# EAGLE design NewUD001 (EAGLE 6.1)
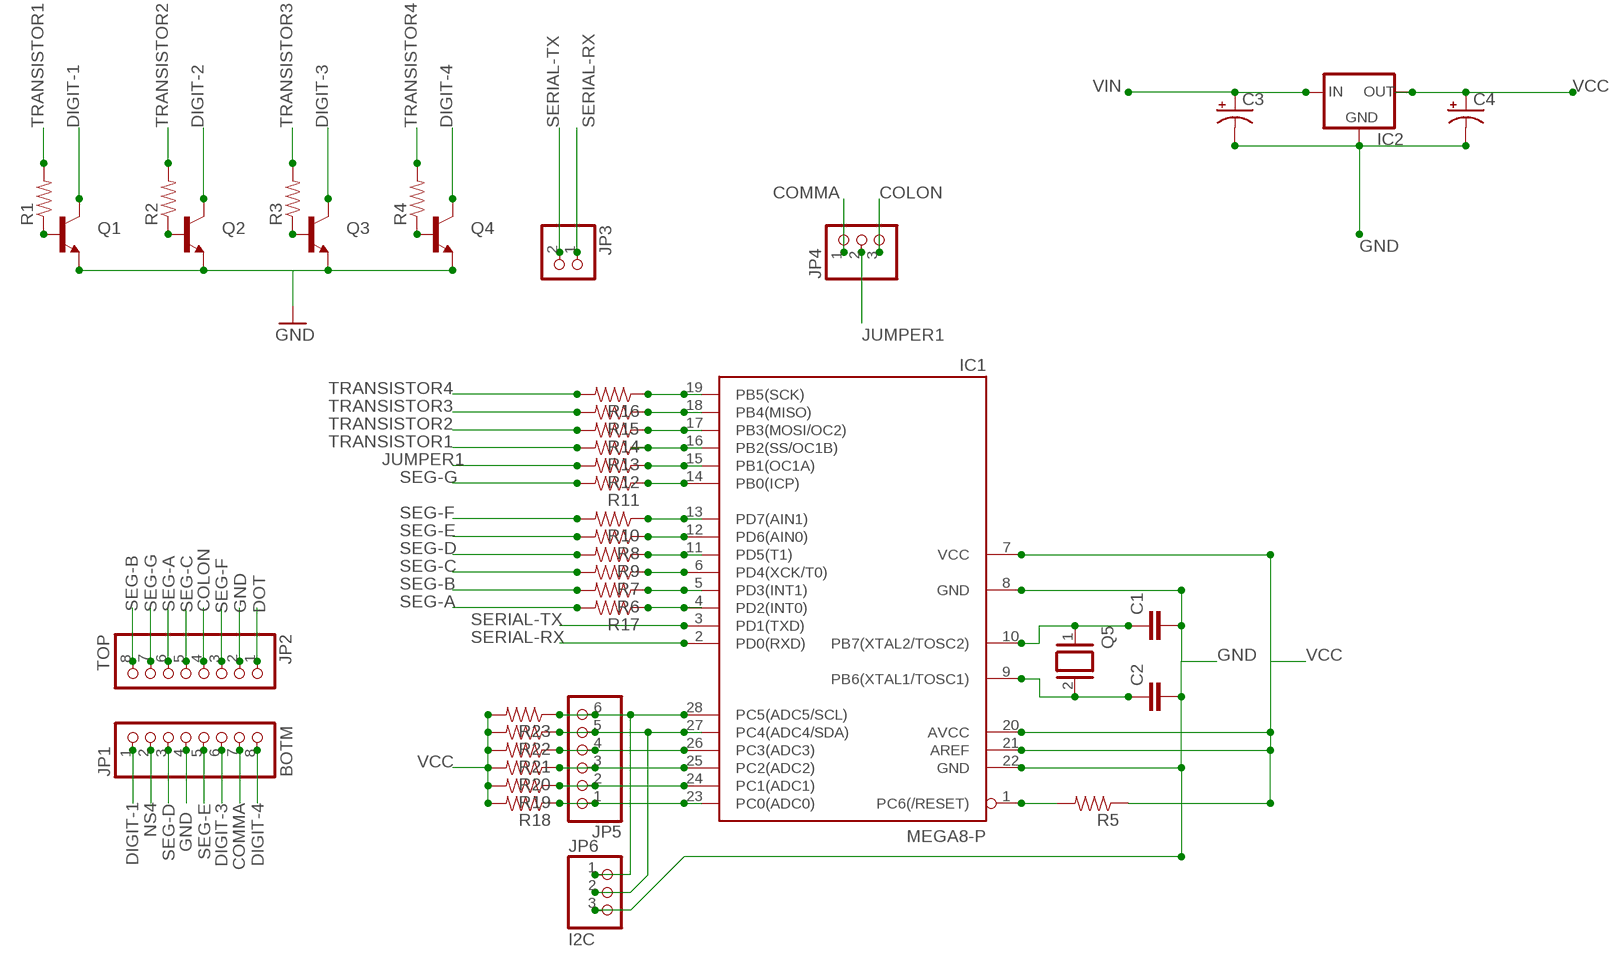
[diagram p0: schematic, sheet 1]

## Parts
C1  CAPKIT  [CAP-PTH-SMALL-KIT]
C2  CAPKIT  [CAP-PTH-SMALL-KIT]
C3  CAP_POLPTH1  [CPOL-RADIAL-100UF-25V]
C4  CAP_POLPTH2  [CPOL-RADIAL-10UF-25V]
IC1  MEGA8-P  [DIL28-3]
IC2  V_REG_78XX-TO-220  [TO-220-ALT]
JP1  BOTM  PINHD-1X8  [1X08]
JP2  TOP  PINHD-1X8  [1X08]
JP3  PINHD-1X2  [1X02]
JP4  PINHD-1X3  [1X03]
JP5  PINHD-1X6  [1X06]
JP6  I2C  PINHD-1X3  [1X03]
Q1  TRANSISTOR_NPNSOT23  [SOT23]
Q2  TRANSISTOR_NPNSOT23  [SOT23]
Q3  TRANSISTOR_NPNSOT23  [SOT23]
Q4  TRANSISTOR_NPNSOT23  [SOT23]
Q5  XTAL/S  [QS]
R1  RESISTORKIT  [AXIAL-0.3-KIT]
R2  RESISTORKIT  [AXIAL-0.3-KIT]
R3  RESISTORKIT  [AXIAL-0.3-KIT]
R4  RESISTORKIT  [AXIAL-0.3-KIT]
R5  RESISTORKIT  [AXIAL-0.3-KIT]
R6  RESISTORKIT  [AXIAL-0.3-KIT]
R7  RESISTORKIT  [AXIAL-0.3-KIT]
R8  RESISTORKIT  [AXIAL-0.3-KIT]
R9  RESISTORKIT  [AXIAL-0.3-KIT]
R10  RESISTORKIT  [AXIAL-0.3-KIT]
R11  RESISTORKIT  [AXIAL-0.3-KIT]
R12  RESISTORKIT  [AXIAL-0.3-KIT]
R13  RESISTORKIT  [AXIAL-0.3-KIT]
R14  RESISTORKIT  [AXIAL-0.3-KIT]
R15  RESISTORKIT  [AXIAL-0.3-KIT]
R16  RESISTORKIT  [AXIAL-0.3-KIT]
R17  RESISTORKIT  [AXIAL-0.3-KIT]
R18  RESISTORKIT  [AXIAL-0.3-KIT]
R19  RESISTORKIT  [AXIAL-0.3-KIT]
R20  RESISTORKIT  [AXIAL-0.3-KIT]
R21  RESISTORKIT  [AXIAL-0.3-KIT]
R22  RESISTORKIT  [AXIAL-0.3-KIT]
R23  RESISTORKIT  [AXIAL-0.3-KIT]

## Nets
COLON: JP2.4 JP4.3
COMMA: JP1.7 JP4.1
DIGIT-1: JP1.1 Q1.3(C)
DIGIT-2: Q2.3(C)
DIGIT-3: JP1.6 Q3.3(C)
DIGIT-4: JP1.8 Q4.3(C)
DOT: JP2.1
GND: C2.2 C3.2(-) C4.2(-) IC1.8(GND) IC1.22(GND) IC2.GND JP1.4 JP2.2 JP6.3 Q1.2(E) Q2.2(E) Q3.2(E) Q4.2(E)
JUMPER1: JP4.2 R12.P$2
N$1: C1.1 IC1.10(PB7(XTAL2/TOSC2)) Q5.1
N$2: Q1.1(B) R1.P$1
N$3: Q2.1(B) R2.P$1
N$4: Q3.1(B) R3.P$1
N$5: Q4.1(B) R4.P$1
N$6: C2.1 IC1.9(PB6(XTAL1/TOSC1)) Q5.2
N$7: IC1.1(PC6(/RESET)) R5.P$2
N$8: C1.2
N$9: IC1.5(PD3(INT1)) R6.P$1
N$10: IC1.6(PD4(XCK/T0)) R7.P$1
N$11: IC1.11(PD5(T1)) R9.P$1
N$12: IC1.28(PC5(ADC5/SCL)) JP5.6 JP6.1 R23.P$1
N$13: IC1.27(PC4(ADC4/SDA)) JP5.5 JP6.2 R22.P$1
N$14: IC1.12(PD6(AIN0)) R8.P$1
N$15: IC1.26(PC3(ADC3)) JP5.4 R21.P$1
N$16: IC1.13(PD7(AIN1)) R10.P$1
N$17: IC1.14(PB0(ICP)) R11.P$1
N$18: IC1.15(PB1(OC1A)) R12.P$1
N$19: IC1.16(PB2(SS/OC1B)) R13.P$1
N$20: IC1.17(PB3(MOSI/OC2)) R14.P$1
N$21: IC1.18(PB4(MISO)) R15.P$1
N$22: IC1.19(PB5(SCK)) R16.P$1
N$23: IC1.4(PD2(INT0)) R17.P$1
N$24: IC1.25(PC2(ADC2)) JP5.3 R20.P$1
N$25: IC1.24(PC1(ADC1)) JP5.2 R19.P$1
N$26: IC1.23(PC0(ADC0)) JP5.1 R18.P$1
NS4: JP1.2
SEG-A: JP2.6 R17.P$2
SEG-B: JP2.8 R6.P$2
SEG-C: JP2.5 R7.P$2
SEG-D: JP1.3 R9.P$2
SEG-E: JP1.5 R8.P$2
SEG-F: JP2.3 R10.P$2
SEG-G: JP2.7 R11.P$2
SERIAL-RX: IC1.2(PD0(RXD)) JP3.1
SERIAL-TX: IC1.3(PD1(TXD)) JP3.2
TRANSISTOR1: R1.P$2 R13.P$2
TRANSISTOR2: R2.P$2 R14.P$2
TRANSISTOR3: R3.P$2 R15.P$2
TRANSISTOR4: R4.P$2 R16.P$2
VCC: C4.1(+) IC1.7(VCC) IC1.20(AVCC) IC1.21(AREF) IC2.OUT R5.P$1 R18.P$2 R19.P$2 R20.P$2 R21.P$2 R22.P$2 R23.P$2
VIN: C3.1(+) IC2.IN

## Library data of the parts
C1 C2 = SparkFun-Passives:CAP: Capacitor Standard 0603 ceramic capacitor, and 0.1" leaded capacitor.
C3 C4 = SparkFun-Passives:CAP_POL: Capacitor Polarized These are standard SMD and PTH capacitors. Normally 10uF, 47uF, and 100uF in electrolytic and tantalum varieties. Always verify the external diameter of the through hole cap, it varies with capacity, voltage, and manufacturer. The EIA devices should be standard.
IC1 = atmel:MEGA8-P: MICROCONTROLLER 8 Kbytes FLASH, 1 kbytes SRAM, 512 bytes EEPROM, USART, 4-channel 10 bit ADC, 2-channel 8 bit ADC Pin compatible with Atmega48, ATMega88, ATMega168 Source: avr.lbr; OC_FARNELL: unknown; OC_NEWARK: unknown
IC2 = SparkFun-PowerIC:V_REG_78XX: Voltage Regulator Standard 7805 5V regulator. IGO (Input Ground Output). Spark Fun Electronics SKU : COM-00107
JP1 JP2 = pinhead:PINHD-1X8: PIN HEADER
JP3 = pinhead:PINHD-1X2: PIN HEADER
JP4 JP6 = pinhead:PINHD-1X3: PIN HEADER
JP5 = pinhead:PINHD-1X6: PIN HEADER
Q1-Q4 = SparkFun-DiscreteSemi:TRANSISTOR_NPN: Generic NPN BJT. MMBT2222 is the common NPN we use. Double check against datasheet- not all devices are the same!
Q5 = special:XTAL/S: CRYSTAL
R1-R23 = SparkFun-Passives:RESISTOR: Resistor Basic schematic elements and footprints for 0603, 1206, and PTH resistors.

## Board
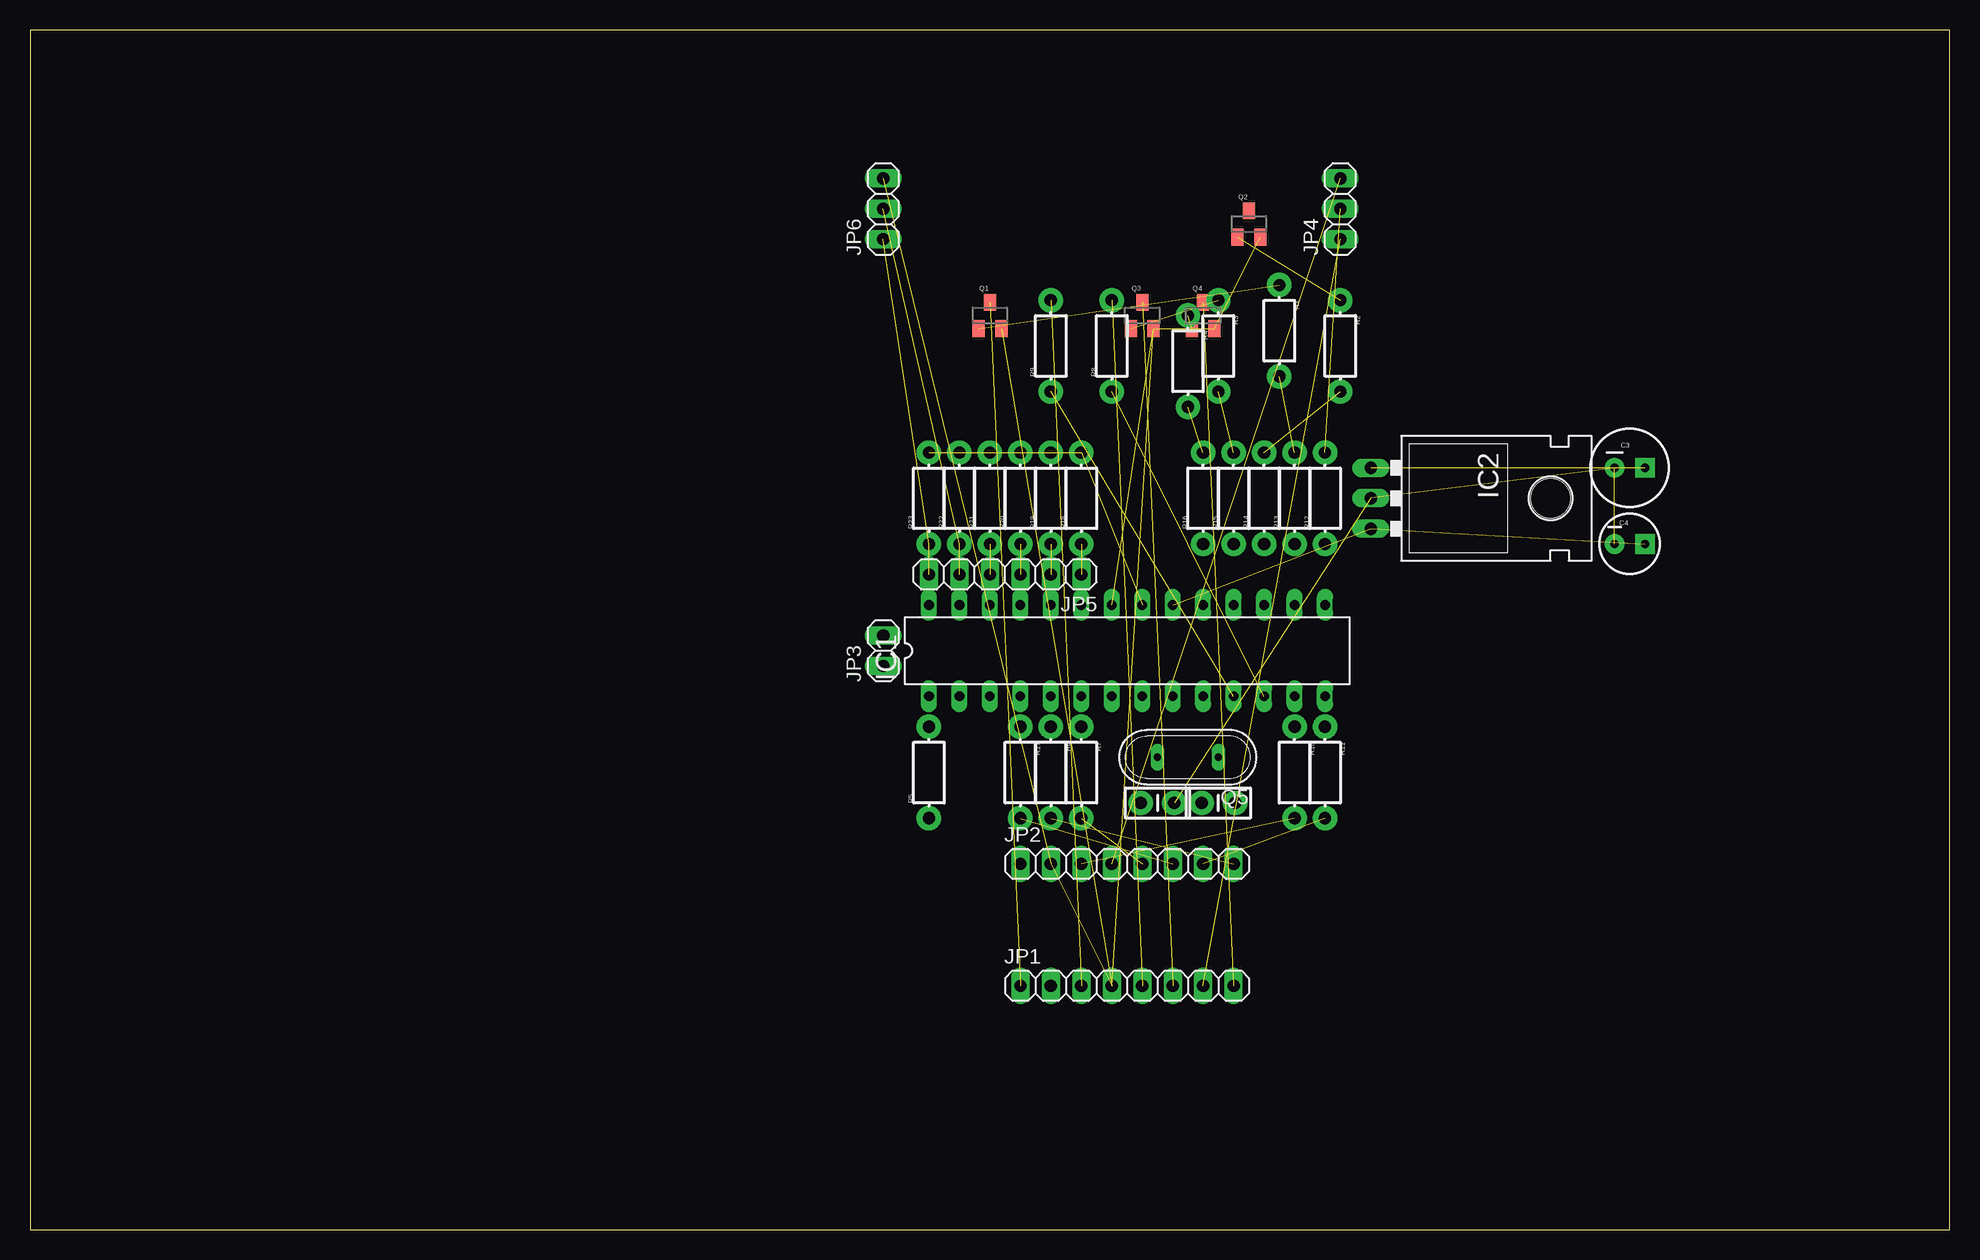
[diagram p1: board, top side]
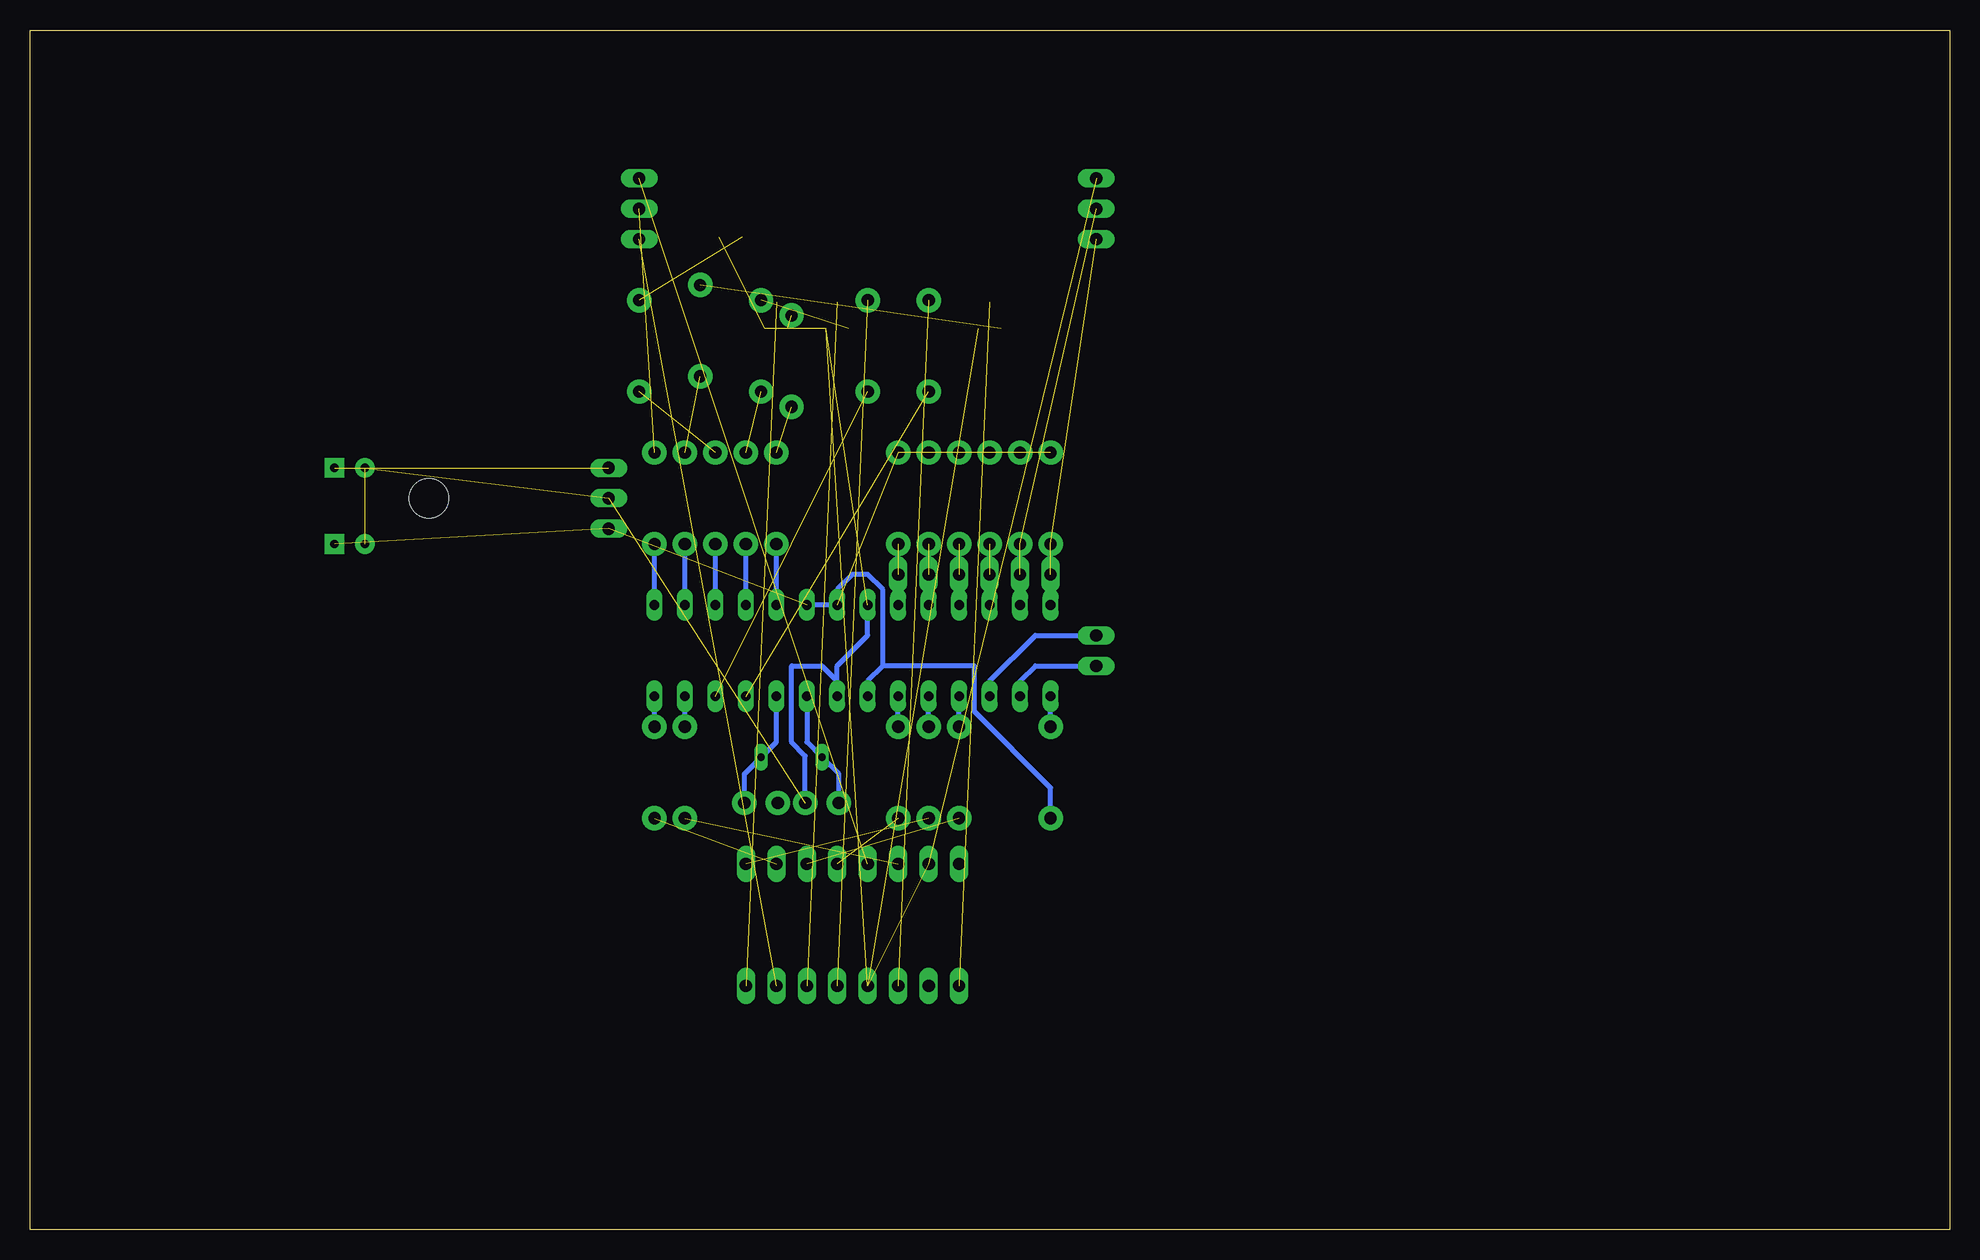
[diagram p2: board, bottom side, seen from below]

Size 160 x 100 mm. Coordinates in mm from the lower left corner, seen from the top.
Outline: 0,0 160,0 160,100 0,100 0,0
Copper layers (1*16): Top 0.035mm / dielectric 1.5mm / Bottom 0.035mm
Design rules: minimum track width 10mil, minimum drill 24mil, track to track 8mil, track to pad 8mil, pad to pad 8mil, via to via 8mil, smd to smd 8mil, copper to edge 40mil, drill to drill 8mil, minimum pad ring 10mil, minimum via ring 8mil, stop-mask expansion 4mil, vias tented up to drill 0mil, thermal gap 10mil

### Footprints (pad centres in the part's own frame; a part is rotated, then mirrored left to right if it is on the bottom)
CAP-PTH-SMALL-KIT = drill 1.016 pad 2.032: 1 -1.397,0; 2 1.397,0
CPOL-RADIAL-100UF-25V = drill 0.7 pad 1.651 square: 1 1.27,0 | drill 0.7 pad 1.651: 2 -1.27,0
CPOL-RADIAL-10UF-25V = drill 0.7 pad 1.651 square: 1 1.27,0 | drill 0.7 pad 1.651: 2 -1.27,0
DIL28-3 = drill 0.813 long: 1 -16.51,-3.81; 2 -13.97,-3.81; 3 -11.43,-3.81; 4 -8.89,-3.81; 5 -6.35,-3.81; 6 -3.81,-3.81; 7 -1.27,-3.81; 8 1.27,-3.81; 9 3.81,-3.81; 10 6.35,-3.81; 11 8.89,-3.81; 12 11.43,-3.81; 13 13.97,-3.81; 14 16.51,-3.81; 15 16.51,3.81; 16 13.97,3.81; 17 11.43,3.81; 18 8.89,3.81; 19 6.35,3.81; 20 3.81,3.81; 21 1.27,3.81; 22 -1.27,3.81; 23 -3.81,3.81; 24 -6.35,3.81; 25 -8.89,3.81; 26 -11.43,3.81; 27 -13.97,3.81; 28 -16.51,3.81
TO-220-ALT = drill 1.016 long: GND 0,-3.81; IN -2.54,-3.81; OUT 2.54,-3.81 | hole 3.302: 0,11.176
1X08 = drill 1.016 long: 1 -8.89,0; 2 -6.35,0; 3 -3.81,0; 4 -1.27,0; 5 1.27,0; 6 3.81,0; 7 6.35,0; 8 8.89,0
1X02 = drill 1.016 long: 1 -1.27,0; 2 1.27,0
1X03 = drill 1.016 long: 1 -2.54,0; 2 0,0; 3 2.54,0
1X06 = drill 1.016 long: 1 -6.35,0; 2 -3.81,0; 3 -1.27,0; 4 1.27,0; 5 3.81,0; 6 6.35,0
SOT23 = smd 1 x 1.4: 1 -0.95,-1.1; 2 0.95,-1.1; 3 0,1.1
QS = drill 0.61 long: 1 -2.54,0; 2 2.54,0
AXIAL-0.3-KIT = drill 1.016 pad 2.032: P$1 -3.81,0; P$2 3.81,0

### Placement (x,y rotation side)
C1  99.06,35.56 180 top
C2  93.98,35.56 0 top
C3  133.35,63.5 0 top
C4  133.35,57.15 0 top
IC1  91.44,48.26 0 top
IC2  115.57,60.96 270 top
JP1  91.44,20.32 0 top
JP2  91.44,30.48 0 top
JP3  71.12,48.26 90 top
JP4  109.22,85.09 90 top
JP5  81.28,54.61 180 top
JP6  71.12,85.09 90 top
Q1  80.01,76.2 0 top
Q2  101.6,83.82 0 top
Q3  92.71,76.2 0 top
Q4  97.79,76.2 0 top
Q5  96.52,39.37 180 top
R1  104.14,74.93 270 top
R2  109.22,73.66 270 top
R3  99.06,73.66 270 top
R4  96.52,72.39 270 top
R5  74.93,38.1 90 top
R6  85.09,38.1 270 top
R7  87.63,38.1 270 top
R8  90.17,73.66 90 top
R9  85.09,73.66 90 top
R10  105.41,38.1 270 top
R11  107.95,38.1 270 top
R12  107.95,60.96 90 top
R13  105.41,60.96 90 top
R14  102.87,60.96 90 top
R15  100.33,60.96 90 top
R16  97.79,60.96 90 top
R17  82.55,38.1 270 top
R18  87.63,60.96 90 top
R19  85.09,60.96 90 top
R20  82.55,60.96 90 top
R21  80.01,60.96 90 top
R22  77.47,60.96 90 top
R23  74.93,60.96 90 top

### Tracks (layer width: path | path; a pad name or v marks a point on that pad's centre or on a via)
COLON  (1 unrouted)
COMMA  (1 unrouted)
DIGIT-1  (1 unrouted)
DIGIT-3  (1 unrouted)
DIGIT-4  (1 unrouted)
GND  (10 unrouted)
  Bottom 0.406: C2.2 95.38,39.5 96.52,40.64 96.52,46.99 93.98,46.99 92.71,45.72 IC1.8 92.71,46.99 90.17,49.53 IC1.22
JUMPER1  (1 unrouted)
N$1
  Bottom 0.406: C1.1 100.46,37.97 Q5.1 97.79,40.64 IC1.10
N$2  (1 unrouted)
N$3  (1 unrouted)
N$4  (1 unrouted)
N$5  (1 unrouted)
N$6
  Bottom 0.406: IC1.9 95.25,40.64 Q5.2 92.58,37.97 C2.1
N$7
  Bottom 0.406: R5.P$2 IC1.1
N$9
  Bottom 0.406: R6.P$1 IC1.5
N$10
  Bottom 0.406: R7.P$1 IC1.6
N$11  (1 unrouted)
N$12  (2 unrouted)
  Bottom 0.406: IC1.28 R23.P$1
N$13  (2 unrouted)
  Bottom 0.406: IC1.27 R22.P$1
N$14  (1 unrouted)
N$15  (1 unrouted)
  Bottom 0.406: IC1.26 R21.P$1
N$16
  Bottom 0.406: R10.P$1 IC1.13
N$17
  Bottom 0.406: R11.P$1 IC1.14
N$18
  Bottom 0.406: IC1.15 R12.P$1
N$19
  Bottom 0.406: IC1.16 R13.P$1
N$20
  Bottom 0.406: IC1.17 R14.P$1
N$21
  Bottom 0.406: IC1.18 R15.P$1
N$22
  Bottom 0.406: IC1.19 R16.P$1
N$23
  Bottom 0.406: R17.P$1 IC1.4
N$24  (1 unrouted)
  Bottom 0.406: IC1.25 R20.P$1
N$25  (1 unrouted)
  Bottom 0.406: IC1.24 R19.P$1
N$26  (1 unrouted)
  Bottom 0.406: IC1.23 R18.P$1
SEG-A  (1 unrouted)
SEG-B  (1 unrouted)
SEG-C  (1 unrouted)
SEG-D  (1 unrouted)
SEG-E  (1 unrouted)
SEG-F  (1 unrouted)
SEG-G  (1 unrouted)
SERIAL-RX
  Bottom 0.406: IC1.2 77.47,45.72 76.2,46.99 JP3.1
SERIAL-TX
  Bottom 0.406: IC1.3 80.01,45.72 76.2,49.53 JP3.2
TRANSISTOR1  (1 unrouted)
TRANSISTOR2  (1 unrouted)
TRANSISTOR3  (1 unrouted)
TRANSISTOR4  (1 unrouted)
VCC  (8 unrouted)
  Bottom 0.406: R5.P$1 74.93,36.83 81.28,43.18 81.28,46.99 88.9,46.99 | 88.9,46.99 90.17,45.72 IC1.7 | IC1.20 IC1.21 92.71,53.34 91.44,54.61 90.17,54.61 88.9,53.34 88.9,46.99
VIN  (1 unrouted)